# Altium project IOT Arduino Board 4 Layers.PrjPcb (part 2 of 2)

## Sheet RS232.SchDoc
size A; SheetNumber: 14; SheetTotal: 15
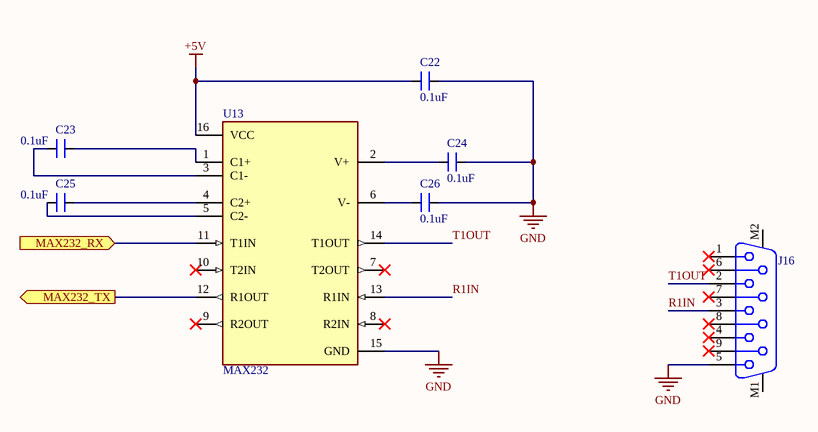
[diagram p12: RS232.SchDoc]

### Parts
C22  0.1uF  [CAP_0805]
C23  0.1uF  [CAP_0805]
C24  0.1uF  [CAP_0805]
C25  0.1uF  [CAP_0805]
C26  0.1uF  [CAP_0805]
J16  618009231121  [618009231121]  (value not drawn)
U13  MAX232  [FP-S16-3-IPC_A]

### Ports
MAX232_RX (in, see Block Diagram[3B]), MAX232_TX (out, see Block Diagram[3B])

### Nets
+5V: C22.2 U13.16(VCC)
GND: C22.1 C24.1 C26.1 J16.5 U13.15(GND)
R1IN: J16.3 U13.13(R1IN)
T1OUT: J16.2 U13.14(T1OUT)
NetC23_1: C23.1 U13.3(C1-)
NetC23_2: C23.2 U13.1(C1+)
NetC24_2: C24.2 U13.2(V+)
NetC25_1: C25.1 U13.5(C2-)
NetC25_2: C25.2 U13.4(C2+)
NetC26_2: C26.2 U13.6(V-)
NetU3_45: U13.12(R1OUT) ; port MAX232_TX
NetU3_46: U13.11(T1IN) ; port MAX232_RX

Not connected (* = marked no-connect by the designer): J16 1* 4* 6* 7* 8* 9* M1 M2; U13 7(T2OUT)* 8(R2IN)* 9(R2OUT)* 10(T2IN)*

### Library data of the parts
C22-C26 = CAP_0.1uF-50V-5%-0805: 0.1µF ±5% 50V Ceramic Capacitor X7R 0805 (2012 Metric); Manufacturer: AVX Corporation; Manufacturer Part Number: 08055C104JAT4A; Alternate Part Number-1: 0805B104M500; Case/Package: 0805; Supplier-1: SIRICOM; Supplier Part Number-1: 0805B104J500CT
J16 = DB-9_RIGHT-ANGLE: Female PCB Connector with Hex Screw WR-DSUB, 8.08 mm, Angled, 9 pins; Manufacturer: Wurth Elektronik; Contact Resistance: 30mOhm; Pin Number: 9; Working Voltage: 125VAC; Rated Current: 3A; Gender: Female; Datasheet URL: https://katalog.we-online.de/em/datasheet/6180xx231121.pdf; Packaging: Tray; Package Reference: 618009231121; Operating Temperature: -40to85degC; Manufacturer URL: http://www.we-online.de; Publisher: WurthElektronik; Mounting Technology: THT; Part Number: 618009231121; Orientation: Angled
U13 = MAX232CSE+T: IC RS-232 DRVR/RCVR 16-SOIC; Manufacturer: Maxim Integrated; Number Of Receivers: 2; Max Supply Voltage: 5.5V; Nominal Supply Current: 5mA; Simplex Duplex: Full Duplex; Min Supply Voltage: 4.5V; Data Rate: 120kbits/s; Standoff Height: 0.1mm; Device Class L1: Integrated Circuits (ICs); Device Class L2: Interface ICs; Package: S16-3; Temperature Range High: +70°C; ComponentLink2Description: Datasheet; Temperature: 0°C to +70°C; Octopart: https://octopart.com/max232cse%2Bt-maxim+integrated-39993384; ComponentLink2URL: https://datasheets.maximintegrated.com/en/ds/MAX220-MAX249.pdf; Manufacturer Part Number: MAX232CSE+T; Automotive: No; Device Class L3: RS-232 / RS-422 / RS-485 Interface ICs; Height: 1.75mm; Number Of Transmitters: 2; Digikey Description: IC RS-232 DRVR/RCVR 16-SOIC; Footprint Url: https://pdfserv.maximintegrated.com/land_patterns/90-0097.PDF; Temperature Range Low: 0°C; Mouser Description: RS-232 Interface IC 5V MultiCh RS-232 Driver/Receiver; Interface: RS-232; RoHS: TRUE; Lead Free: Yes; Category: IC

## Sheet RS485.SchDoc
size A; SheetNumber: 15; SheetTotal: 15
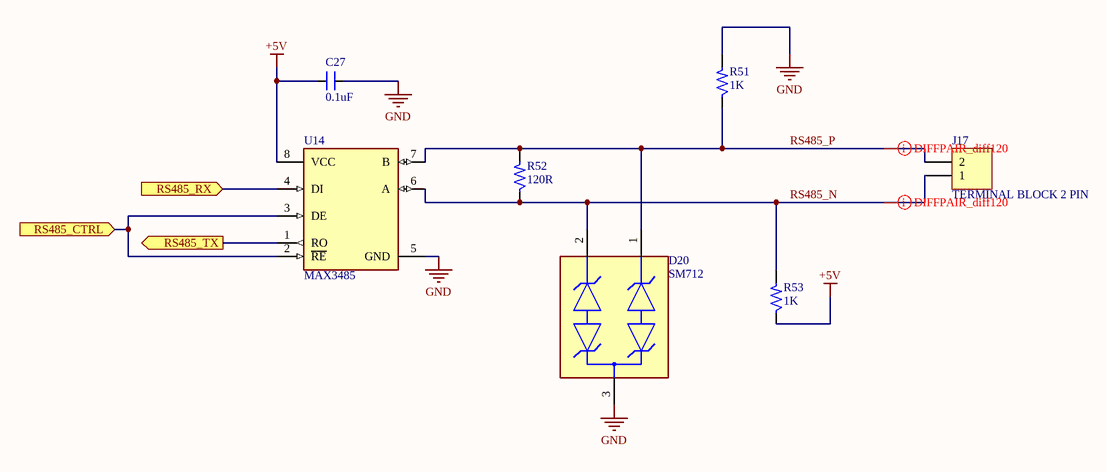
[diagram p13: RS485.SchDoc]

### Parts
C27  0.1uF  [CAP_0805]
D20  SM712  [FP-SM712-MFG]
J17  TERMINAL BLOCK 2 PIN  [CON2_P196_1729128_TH_ST]
R51  1K  [RES_0805]
R52  120R  [RES_0805]
R53  1K  [RES_0805]
U14  MAX3485  [FP-S8-5-IPC_C]

### Ports
RS485_CTRL (in, see Block Diagram[3C], ATMEGA2560-16AU[2C]), RS485_RX (in, see Block Diagram[3C]), RS485_TX (out, see Block Diagram[3C])

### Nets
+5V: C27.2 R53.1 U14.8(VCC)
GND: C27.1 D20.3 R51.2 U14.5(GND)
RS485_N: D20.2 J17.1 R52.1 R53.2 U14.6(A)
RS485_P: D20.1 J17.2 R51.1 R52.2 U14.7(B)
NetU3_63: U14.1(RO) ; port RS485_TX
NetU3_64: U14.4(DI) ; port RS485_RX
NetU3_65: U14.2(~{RE}) U14.3(DE) ; port RS485_CTRL

### Layout directives
differential pair; differential pair class DIFFPAIR_diff120: RS485_N, RS485_P

### Library data of the parts
C27 = CAP_0.1uF-50V-5%-0805: as C22 on sheet RS232; Case/Package: 0805; Supplier-1: SIRICOM; Supplier Part Number-1: 0805B104J500CT; ClassName: RS485
D20 = SM712-02HTG: TVS DIODE 12V 31V SOT23-3; Leakage Current: 20uA; Polarity: Bidirectional; Breakdown Voltage: 13.3V; Max Power Dissipation: 600W; Number of Channels: 2; Max Surge Current: 19A; Capacitance: 75pF; Power Line Protection: No; Element Configuration: Dual; Number of Pins: 3; Radiation Hardening: No; Clamping Voltage: 31V; Mount: Surface Mount; Reverse Standoff Voltage: 12V; Peak Pulse Power: 600W; Lead Free: Lead Free; Direction: Bidirectional; Packaging: Tape and Reel; Case/Package: SOT-23-3; Number of Bidirectional Channels: 2; Termination: SMD/SMT; Max Operating Temperature: 125°C; Min Breakdown Voltage: 13.3V; Depth: 1.4mm; Package Quantity: 3000; Working Voltage: 12V; Length: 3.04mm; Peak Pulse Current: 19A; Composition: Zener; Min Operating Temperature: -40°C; ClassName: RS485
J17 = CON-TB_2X1-196-ST-TH: 2 Pins, 1 Row 5mm Pitch, straight Connector, male; Manufacturer: Phoenix Contact; Manufacturer Part Number: MKDSN1,5/2; Alternate Part Number-1: NA; Case/Package: TH-CON; Supplier-1: SP ROAD; Supplier Part Number-1: MKDSN1,5/2; ClassName: RS485
R51 R53 = RES_1K-0.125W-1%-0805: 1 kOhms ±1% 0.125W, 1/8W Chip Resistor 0805 (2012 Metric) Moisture Resistant Thick Film; Manufacturer: Walsin; Manufacturer Part Number: WR08X1001FTL; Case/Package: 0805; Supplier-1: SP ROAD; Supplier Part Number-1: RC0805JR-071KL; Alternate Part Number-1: WR08X1001FTL; ClassName: RS485
R52 = RES_120R-0.125W-1%-0805: 120 Ohms ±1% 0.125W, 1/8W Chip Resistor 0805 (2012 Metric) Automotive AEC-Q200, Moisture Resistant Thick Film; Manufacturer: Stackpole Electronics; Manufacturer Part Number: CRGCQ0805F120R; Alternate Part Number-1: NA; Case/Package: 0805; Supplier-1: SIRICOM; Supplier Part Number-1: WR08X1200FTL; ClassName: RS485
U14 = MAX3485ESA+: IC TXRX RS485/422 10MBPS 8SOIC; Manufacturer: Maxim Integrated; Nominal Supply Current: 0.95-1.1mA; Data Rate: 10Mbits/s; Min Supply Voltage: 3V; Interface: RS-485,RS-422; Number Of Transmitters: 1; Max Supply Voltage: 3.6V; Max Junction Temp: +160°C; Standoff Height: 0.1mm; Simplex Duplex: Half Duplex; Height: 1.75mm; Temperature Range High: +85°C; Device Class L2: Interface ICs; Digikey Description: IC TXRX RS485/422 10MBPS 8SOIC; Temperature: -40°C to +85°C; Device Class L3: RS-232 / RS-422 / RS-485 Interface ICs; Temperature Range Low: -40°C; Footprint Url: https://pdfserv.maximintegrated.com/land_patterns/90-0096.PDF; Category: IC; ComponentLink2URL: https://datasheets.maximintegrated.com/en/ds/MAX3483-MAX3491.pdf; Package: S8-5; Octopart: https://octopart.com/max3485esa%2B-maxim+integrated-39731860; RoHS: TRUE; Manufacturer Part Number: MAX3485ESA+; Lead Free: Yes; ComponentLink2Description: Datasheet; Device Class L1: Integrated Circuits (ICs); Mouser Description: 3.3V Powered, 10Mbps and Slew-Rate Limited, True RS-485/RS-422 Transceivers; Number Of Receivers: 1; Automotive: No; ClassName: RS485

## Sheet SPI Bus Transceiver.SchDoc
size A; SheetNumber: 12; SheetTotal: 15
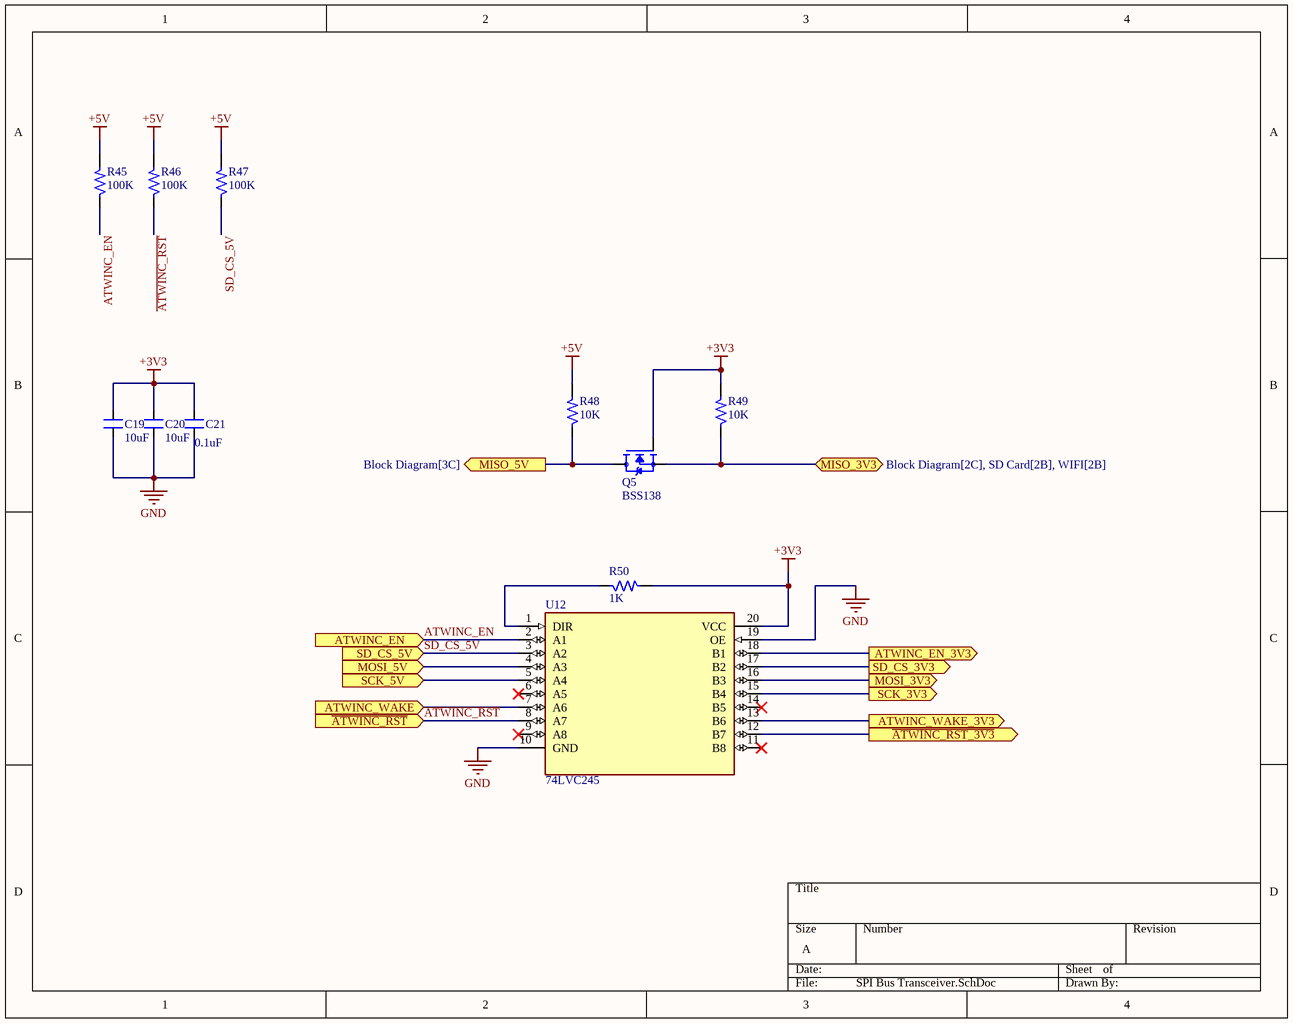
[diagram p14: SPI Bus Transceiver.SchDoc]

### Parts
C19  10uF  [CAP_1206]
C20  10uF  [CAP_1206]
C21  0.1uF  [CAP_0805]
Q5  BSS138  [SOT95P240X111-3N]
R45  100K  [RES_0805]
R46  100K  [RES_0805]
R47  100K  [RES_0805]
R48  10K  [RES_0805]
R49  10K  [RES_0805]
R50  1K  [RES_0805]
U12  74LVC245  [SOIC-20-W]

### Ports
ATWINC_EN (in, see Block Diagram[3C], ATMEGA2560-16AU[1A]), ATWINC_EN_3V3 (out, see Block Diagram[2C], WIFI[2C]), ATWINC_WAKE (in, see Block Diagram[3C], ATMEGA2560-16AU[1A]), ATWINC_WAKE_3V3 (out, see Block Diagram[2C], WIFI[2C]), MISO_3V3 (bidir, see Block Diagram[2C], SD Card[2B], WIFI[2B]), MISO_5V (out, see Block Diagram[3C]), MOSI_3V3 (out, see Block Diagram[2C], SD Card[3B], WIFI[2B]), MOSI_5V (in, see Block Diagram[3C]), SCK_3V3 (out, see Block Diagram[2C], SD Card[2B], WIFI[2B]), SCK_5V (in, see Block Diagram[3C]), SD_CS_3V3 (out, see Block Diagram[2C], SD Card[2B]), SD_CS_5V (in, see Block Diagram[3C], ATMEGA2560-16AU[1B]), ~{ATWINC_RST_3V3} (out, see Block Diagram[2C], WIFI[4B]), ~{ATWINC_RST} (in, see Block Diagram[3C], ATMEGA2560-16AU[1A])

### Nets
+3V3: C19.2 C20.2 C21.2 Q5.1(G) R49.2 R50.2 U12.20(VCC)
+5V: R45.2 R46.2 R47.2 R48.2
GND: C19.1 C20.1 C21.1 U12.10(GND) U12.19(OE)
~{ATWINC_RST}: R46.1 U12.8(A7) ; port ~{ATWINC_RST}
ATWINC_EN: R45.1 U12.2(A1) ; port ATWINC_EN
MISO: Q5.3(D) R48.1 ; port MISO_5V
MOSI: U12.4(A3) ; port MOSI_5V
SCK: U12.5(A4) ; port SCK_5V
SD_CS_5V: R47.1 U12.3(A2) ; port SD_CS_5V
NetJ15_2: U12.17(B2) ; port SD_CS_3V3
NetJ15_3: U12.16(B3) ; port MOSI_3V3
NetJ15_5: U12.15(B4) ; port SCK_3V3
NetJ15_7: Q5.2(S) R49.1 ; port MISO_3V3
NetR42_1: U12.18(B1) ; port ATWINC_EN_3V3
NetR50_1: R50.1 U12.1(DIR)
NetU3_9: U12.7(A6) ; port ATWINC_WAKE
NetU11_4: U12.12(B7) ; port ~{ATWINC_RST_3V3}
NetU11_11: U12.13(B6) ; port ATWINC_WAKE_3V3

Not connected (* = marked no-connect by the designer): U12 6(A5)* 9(A8)* 11(B8)* 14(B5)*

### Library data of the parts
C19 C20 = CAP_10uF-50V-10%-1206: 10µF ±10% 50V Ceramic Capacitor X7R 1206 (3216 Metric); Manufacturer: KEMET; Manufacturer Part Number: CL31B106KBHNNNE; Alternate Part Number-1: GRT31CR61H106ME01L; Case/Package: 1206; Supplier-1: SIRICOM; Supplier Part Number-1: CC1206KKX5R9BB106
C21 = CAP_0.1uF-50V-5%-0805: as C22 on sheet RS232; Case/Package: 0805; Supplier-1: SIRICOM; Supplier Part Number-1: 0805B104J500CT
Q5 = BSS138: N-Channel 50V 220mA (Ta) 360mW (Ta) Surface Mount SOT-23-3; Price: None; MP: BSS138; Value: *; Availability: Unavailable; Package: None
R45-R47 = RES_100K-0.125W-1%-0805: 100 kOhms ±1% 0.125W, 1/8W Chip Resistor 0805 (2012 Metric) Automotive AEC-Q200 Thick Film; Manufacturer: Walsin; Manufacturer Part Number: WR08X1003FTL; Alternate Part Number-1: NA; Case/Package: 0805; Supplier-1: SIRICOM; Supplier Part Number-1: WR08X1003FTL
R48 R49 = RES_10K-0.125W-1%-0805: 10 kOhms ±1% 0.125W, 1/8W Chip Resistor 0805 (2012 Metric) Automotive AEC-Q200 Thick Film; Manufacturer: CTS; Manufacturer Part Number: WR08X1002FTL; Case/Package: 0805; Supplier-1: SIRICOM; Supplier Part Number-1: WR08X1002FTL; Alternate Part Number-1: WR08X1002FTL
R50 = RES_1K-0.125W-1%-0805: as R51 on sheet RS485; Case/Package: 0805; Supplier-1: SP ROAD; Supplier Part Number-1: RC0805JR-071KL; Alternate Part Number-1: WR08X1001FTL
U12 = 74LVC245: Transceiver, Non-Inverting 1 Element 8 Bit per Element 3-State Output 20-TSSOP; MF: ON Semiconductor; Package: TSSOP-20 ON Semiconductor; Check_prices: https://www.snapeda.com/parts/74LVC245/Onsemi/view-part/?ref=eda; Value: *; Price: None; MP: 74LVC245; Availability: In Stock; SnapEDA_Link: https://www.snapeda.com/parts/74LVC245/Onsemi/view-part/?ref=snap

## Nets that join several sheets
+3V3: Power Supply (C5.1 C6.2 U2.2 U2.4), BLE (J14.2 U10.5), WIFI (9 pins), SD Card (J15.4 R44.1), SPI Bus Transceiver (7 pins)
+5V: ATMEGA2560-16AU (12 pins), Power Supply (7 pins), Relay Driver (U4.4 U5.4), DC Motor Speed (U6.4), Digital Input (U7.10 U7.12 U7.14 U7.16), RTC (C17.2 C18.2 U15.8), RS232 (C22.2 U13.16), RS485 (C27.2 R53.1 U14.8), SPI Bus Transceiver (R45.2 R46.2 R47.2 R48.2)
AGND: Power Supply (FB2.1), 4-20mA Sensor (10 pins)
GND: ATMEGA2560-16AU (16 pins), Power Supply (16 pins), Relay Driver (U4.2 U5.2), DC Motor Speed (U6.2), Digital Input (8 pins), Analog Input (8 pins), RTC (BT.NEG C17.1 C18.1 U15.4), BLE (J14.3 U10.1 U10.3), WIFI (5 pins), SD Card (5 pins), RS232 (5 pins), RS485 (C27.1 D20.3 R51.2 U14.5), SPI Bus Transceiver (5 pins)
GND_ISO: Relay Driver (Q2.2 Q3.2), DC Motor Speed (J7.1 Q4.3)
MTR/RLY: Relay Driver (D5.2 D21.2 J4.2 J5.2), DC Motor Speed (D7.1 J6.2 J7.2)
VCCA: Power Supply (FB1.1), 4-20mA Sensor (9 pins)
~{ATWINC_RST}: ATMEGA2560-16AU (U3.8), SPI Bus Transceiver (R46.1 U12.8)
ATWINC_EN: ATMEGA2560-16AU (U3.7), SPI Bus Transceiver (R45.1 U12.2)
MISO: ATMEGA2560-16AU (J2.1 U3.22), SPI Bus Transceiver (Q5.3 R48.1)
MOSI: ATMEGA2560-16AU (J2.4 U3.21), SPI Bus Transceiver (U12.4)
NetD12_K: ATMEGA2560-16AU (U3.85), Analog Input (D12.K R20.2 R21.2)
NetD13_K: ATMEGA2560-16AU (U3.84), Analog Input (D13.K R19.2 R22.2)
NetD14_K: ATMEGA2560-16AU (U3.83), Analog Input (D14.K R18.2 R23.2)
NetD15_K: ATMEGA2560-16AU (U3.82), Analog Input (D15.K R17.2 R24.2)
NetJ14_1: ATMEGA2560-16AU (U3.50), BLE (J14.1)
NetJ14_4: ATMEGA2560-16AU (U3.12), BLE (J14.4)
NetJ14_6: ATMEGA2560-16AU (U3.49), BLE (J14.6)
NetJ15_2: SD Card (J15.2), SPI Bus Transceiver (U12.17)
NetJ15_3: WIFI (U11.15), SD Card (J15.3), SPI Bus Transceiver (U12.16)
NetJ15_5: WIFI (U11.18), SD Card (J15.5), SPI Bus Transceiver (U12.15)
NetJ15_7: WIFI (U11.17), SD Card (J15.7), SPI Bus Transceiver (Q5.2 R49.1)
NetJ15_CD: ATMEGA2560-16AU (U3.1), SD Card (J15.CD R44.2)
NetR7_1: ATMEGA2560-16AU (R7.1 U3.43), 4-20mA Sensor (U9.10), RTC (U15.6)
NetR8_1: ATMEGA2560-16AU (R8.1 U3.44), 4-20mA Sensor (U9.9), RTC (U15.5)
NetR9_2: ATMEGA2560-16AU (U3.54), Relay Driver (R9.2)
NetR11_2: ATMEGA2560-16AU (U3.53), Relay Driver (R11.2)
NetR13_2: ATMEGA2560-16AU (U3.15), DC Motor Speed (R13.2)
NetR16_5: ATMEGA2560-16AU (U3.69), Digital Input (R16.5 U7.9)
NetR16_6: ATMEGA2560-16AU (U3.68), Digital Input (R16.6 U7.11)
NetR16_7: ATMEGA2560-16AU (U3.67), Digital Input (R16.7 U7.13)
NetR16_8: ATMEGA2560-16AU (U3.66), Digital Input (R16.8 U7.15)
NetR42_1: WIFI (R42.1), SPI Bus Transceiver (U12.18)
NetR43_2: ATMEGA2560-16AU (U3.6), WIFI (R43.2)
NetU3_9: ATMEGA2560-16AU (U3.9), SPI Bus Transceiver (U12.7)
NetU3_13: ATMEGA2560-16AU (U3.13), BLE (U10.2)
NetU3_45: ATMEGA2560-16AU (U3.45), RS232 (U13.12)
NetU3_46: ATMEGA2560-16AU (U3.46), RS232 (U13.11)
NetU3_63: ATMEGA2560-16AU (U3.63), RS485 (U14.1)
NetU3_64: ATMEGA2560-16AU (U3.64), RS485 (U14.4)
NetU3_65: ATMEGA2560-16AU (U3.65), RS485 (U14.2 U14.3)
NetU11_4: WIFI (U11.4), SPI Bus Transceiver (U12.12)
NetU11_11: WIFI (U11.11), SPI Bus Transceiver (U12.13)
SCK: ATMEGA2560-16AU (J2.3 U3.20), SPI Bus Transceiver (U12.5)
SD_CS_5V: ATMEGA2560-16AU (U3.23), SPI Bus Transceiver (R47.1 U12.3)